# Altium project cover.PrjPCB
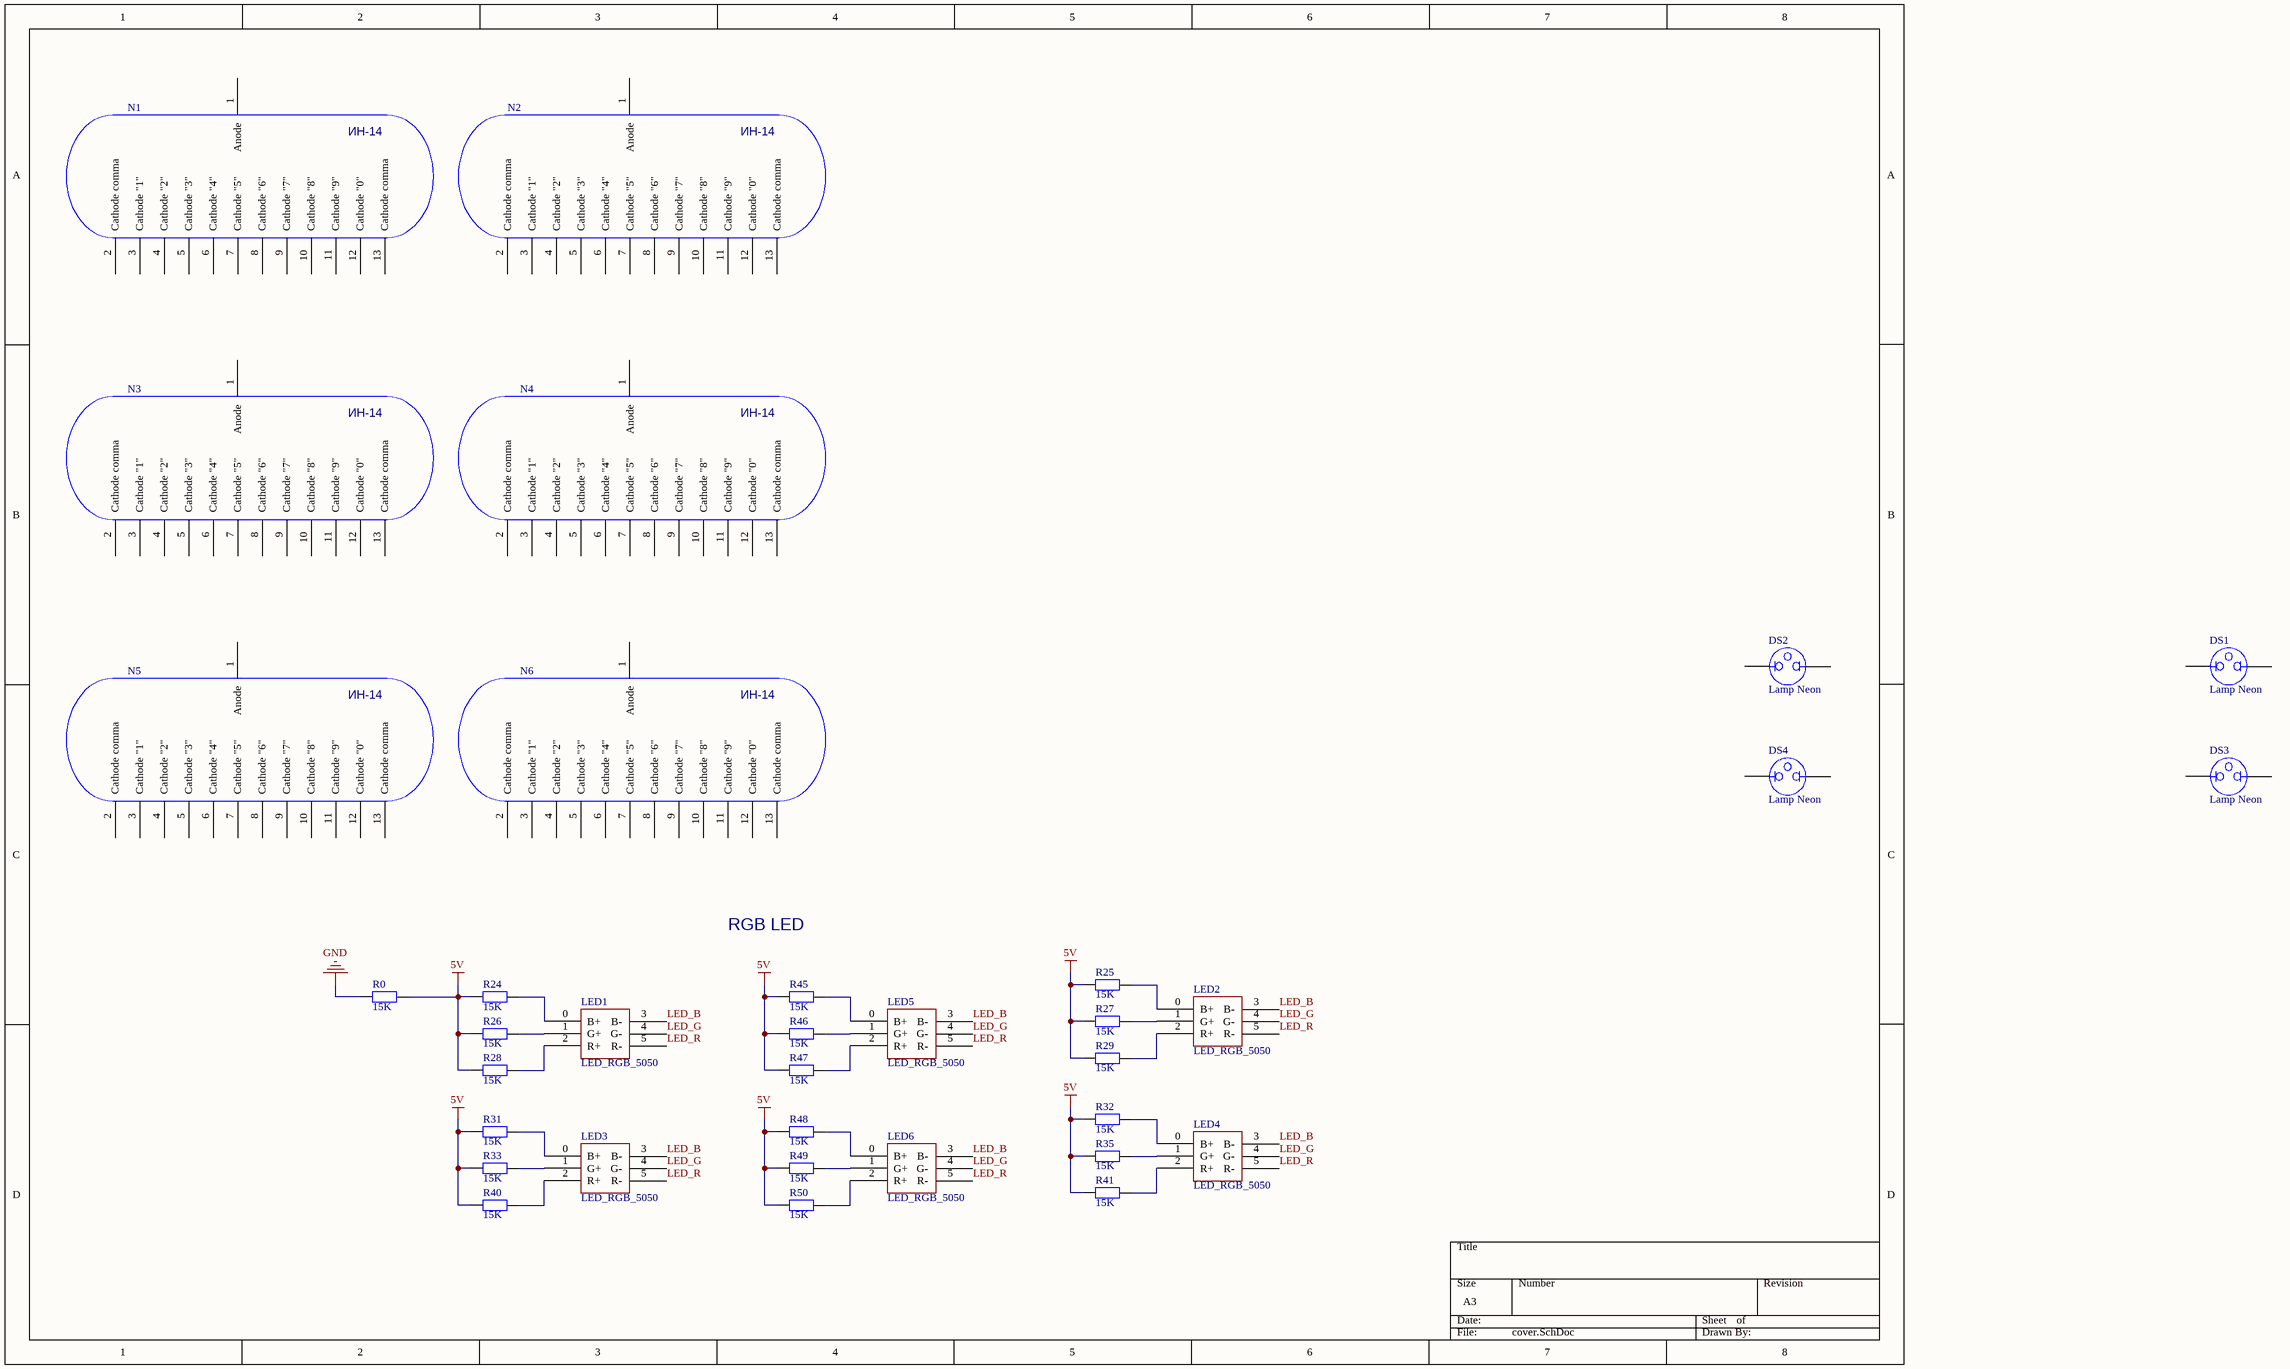
[diagram p0: cover.SchDoc]
1 sheet, 35 parts. Net scope: global (net labels, ports and power ports of the same name join across sheets).
Board files: cover.PcbDoc, cover1.PcbDoc, cover3.PcbDoc, ykl.PcbDoc

## Sheet cover.SchDoc
size A3

### Parts
DS1  Lamp Neon  [LED_PIN2]
DS2  Lamp Neon  [LED_PIN2]
DS3  Lamp Neon  [LED_PIN2]
DS4  Lamp Neon  [LED_PIN2]
LED1  LED_RGB_5050  [LED_RGB_5050]
LED2  LED_RGB_5050  [LED_RGB_5050]
LED3  LED_RGB_5050  [LED_RGB_5050]
LED4  LED_RGB_5050  [LED_RGB_5050]
LED5  LED_RGB_5050  [LED_RGB_5050]
LED6  LED_RGB_5050  [LED_RGB_5050]
N1  ИН-14  [IN14]  (value not drawn)
N2  ИН-14  [IN14]  (value not drawn)
N3  ИН-14  [IN14]  (value not drawn)
N4  ИН-14  [IN14]  (value not drawn)
N5  ИН-14  [IN14]  (value not drawn)
N6  ИН-14  [IN14]  (value not drawn)
R0  value 15K  [R 0603]  (hidden comment: Res2)
R24  value 15K  [R 0603]  (hidden comment: Res2)
R25  value 15K  [R 0603]  (hidden comment: Res2)
R26  value 15K  [R 0603]  (hidden comment: Res2)
R27  value 15K  [R 0603]  (hidden comment: Res2)
R28  value 15K  [R 0603]  (hidden comment: Res2)
R29  value 15K  [R 0603]  (hidden comment: Res2)
R31  value 15K  [R 0603]  (hidden comment: Res2)
R32  value 15K  [R 0603]  (hidden comment: Res2)
R33  value 15K  [R 0603]  (hidden comment: Res2)
R35  value 15K  [R 0603]  (hidden comment: Res2)
R40  value 15K  [R 0603]  (hidden comment: Res2)
R41  value 15K  [R 0603]  (hidden comment: Res2)
R45  value 15K  [R 0603]  (hidden comment: Res2)
R46  value 15K  [R 0603]  (hidden comment: Res2)
R47  value 15K  [R 0603]  (hidden comment: Res2)
R48  value 15K  [R 0603]  (hidden comment: Res2)
R49  value 15K  [R 0603]  (hidden comment: Res2)
R50  value 15K  [R 0603]  (hidden comment: Res2)

### Nets
5V: R0.1 R24.2 R25.2 R26.2 R27.2 R28.2 R29.2 R31.2 R32.2 R33.2 R35.2 R40.2 R41.2 R45.2 R46.2 R47.2 R48.2 R49.2 R50.2
GND: R0.2
LED_B: LED1.3(B-) LED2.3(B-) LED3.3(B-) LED4.3(B-) LED5.3(B-) LED6.3(B-)
LED_G: LED1.4(G-) LED2.4(G-) LED3.4(G-) LED4.4(G-) LED5.4(G-) LED6.4(G-)
LED_R: LED1.5(R-) LED2.5(R-) LED3.5(R-) LED4.5(R-) LED5.5(R-) LED6.5(R-)
NetLED1_0: LED1.0(B+) R24.1
NetLED1_1: LED1.1(G+) R26.1
NetLED1_2: LED1.2(R+) R28.1
NetLED2_0: LED2.0(B+) R25.1
NetLED2_1: LED2.1(G+) R27.1
NetLED2_2: LED2.2(R+) R29.1
NetLED3_0: LED3.0(B+) R31.1
NetLED3_1: LED3.1(G+) R33.1
NetLED3_2: LED3.2(R+) R40.1
NetLED4_0: LED4.0(B+) R32.1
NetLED4_1: LED4.1(G+) R35.1
NetLED4_2: LED4.2(R+) R41.1
NetLED5_0: LED5.0(B+) R45.1
NetLED5_1: LED5.1(G+) R46.1
NetLED5_2: LED5.2(R+) R47.1
NetLED6_0: LED6.0(B+) R48.1
NetLED6_1: LED6.1(G+) R49.1
NetLED6_2: LED6.2(R+) R50.1

Not connected (* = marked no-connect by the designer): DS1 1 2; DS2 1 2; DS3 1 2; DS4 1 2; N1 1(Anode) 2(Cathode_comma) 3(Cathode_"1") 4(Cathode_"2") 5(Cathode_"3") 6(Cathode_"4") 7(Cathode_"5") 8(Cathode_"6") 9(Cathode_"7") 10(Cathode_"8") 11(Cathode_"9") 12(Cathode_"0") 13(Cathode_comma); N2 1(Anode) 2(Cathode_comma) 3(Cathode_"1") 4(Cathode_"2") 5(Cathode_"3") 6(Cathode_"4") 7(Cathode_"5") 8(Cathode_"6") 9(Cathode_"7") 10(Cathode_"8") 11(Cathode_"9") 12(Cathode_"0") 13(Cathode_comma); N3 1(Anode) 2(Cathode_comma) 3(Cathode_"1") 4(Cathode_"2") 5(Cathode_"3") 6(Cathode_"4") 7(Cathode_"5") 8(Cathode_"6") 9(Cathode_"7") 10(Cathode_"8") 11(Cathode_"9") 12(Cathode_"0") 13(Cathode_comma); N4 1(Anode) 2(Cathode_comma) 3(Cathode_"1") 4(Cathode_"2") 5(Cathode_"3") 6(Cathode_"4") 7(Cathode_"5") 8(Cathode_"6") 9(Cathode_"7") 10(Cathode_"8") 11(Cathode_"9") 12(Cathode_"0") 13(Cathode_comma); N5 1(Anode) 2(Cathode_comma) 3(Cathode_"1") 4(Cathode_"2") 5(Cathode_"3") 6(Cathode_"4") 7(Cathode_"5") 8(Cathode_"6") 9(Cathode_"7") 10(Cathode_"8") 11(Cathode_"9") 12(Cathode_"0") 13(Cathode_comma); N6 1(Anode) 2(Cathode_comma) 3(Cathode_"1") 4(Cathode_"2") 5(Cathode_"3") 6(Cathode_"4") 7(Cathode_"5") 8(Cathode_"6") 9(Cathode_"7") 10(Cathode_"8") 11(Cathode_"9") 12(Cathode_"0") 13(Cathode_comma)

### Notes on the sheet
- RGB LED

### Library data of the parts
DS1-DS4 = Lamp Neon: Neon Lamp; Published: 24-Mar-1999; LatestRevisionDate: 17-Jul-2002; LatestRevisionNote: Re-released for DXP Platform.; PackageReference: PIN2; Publisher: Altium Limited
R0 R24-R29 R31-R33 R35 R40 R41 R45-R50 = Res2: Resistor; Published: 8-Jun-2000; LatestRevisionDate: 17-Jul-2002; LatestRevisionNote: Re-released for DXP Platform.; PackageReference: AXIAL-0.4; Publisher: Altium Limited; PackageDescription: Axial Device, Thru-Hole; 2 Leads; 0.4 in Pin Spacing